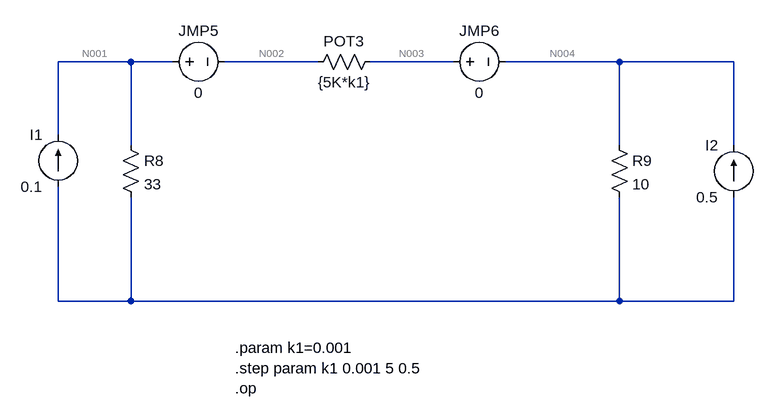
[diagram p0: schematic 52.asc]
52.asc, the LTspice schematic file:
Version 4.1
SHEET 1 1016 680
WIRE 32 -48 -80 -48
WIRE 96 -48 32 -48
WIRE 320 -48 176 -48
WIRE 528 -48 400 -48
WIRE 784 -48 608 -48
WIRE 960 -48 784 -48
WIRE -80 64 -80 -48
WIRE 32 80 32 -48
WIRE 784 80 784 -48
WIRE 960 80 960 -48
WIRE -80 320 -80 144
WIRE 32 320 32 160
WIRE 32 320 -80 320
WIRE 784 320 784 160
WIRE 784 320 32 320
WIRE 960 320 960 160
WIRE 960 320 784 320
SYMBOL res 416 -64 R90
WINDOW 0 0 56 VBottom 2
WINDOW 3 32 56 VTop 2
SYMATTR InstName POT3
SYMATTR Value {5K*k1}
SYMBOL voltage 512 -48 R270
WINDOW 0 32 56 VTop 2
WINDOW 3 -32 56 VBottom 2
SYMATTR InstName JMP6
SYMATTR Value 0
SYMBOL voltage 80 -48 R270
WINDOW 0 32 56 VTop 2
WINDOW 3 -32 56 VBottom 2
SYMATTR InstName JMP5
SYMATTR Value 0
SYMBOL res 16 64 R0
SYMATTR InstName R8
SYMATTR Value 33
SYMBOL res 768 64 R0
SYMATTR InstName R9
SYMATTR Value 10
SYMBOL current -80 144 R180
WINDOW 0 24 80 Left 2
WINDOW 3 24 0 Left 2
SYMATTR InstName I1
SYMATTR Value 0.1
SYMBOL current 960 160 R180
WINDOW 0 24 80 Left 2
WINDOW 3 24 0 Left 2
SYMATTR InstName I2
SYMATTR Value 0.5
TEXT 192 392 Left 2 !.param k1=0.001\n.step param k1 0.001 5 0.5\n.op

The netlist it stands for:
* 52.asc
R§POT3 N003 N002 {5K*k1}
V§JMP6 N003 N004 0
V§JMP5 N001 N002 0
R8 N001 N005 33
R9 N004 N005 10
I1 N005 N001 0.1
I2 N005 N004 0.5
.param k1=0.001
.step param k1 0.001 5 0.5
.op
.backanno
.end

* Results of the author's LTspice run, read from the files saved beside the schematic
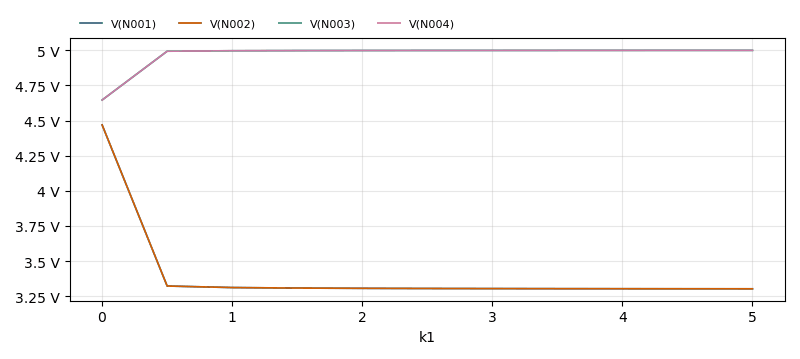
[diagram p1: Operating Point of 52.asc, plotted from the saved traces]
* Operating Point, 1 run:
*   V(N001): 4.469 V at k1=1 m, 3.302 V at k1=5 , min 3.302 V, max 4.469 V
*   V(N002): 4.469 V at k1=1 m, 3.302 V at k1=5 , min 3.302 V, max 4.469 V
*   V(N003): 4.646 V at k1=1 m, 4.999 V at k1=5 , min 4.646 V, max 4.999 V
*   V(N004): 4.646 V at k1=1 m, 4.999 V at k1=5 , min 4.646 V, max 4.999 V